# Altium project SynthyTwo.Project.PrjPcb (part 2 of 2)

## Sheet Encodeurs.Schematic.SchDoc
size A
Used 8 times, as channels A0, A1, B0, B1, C0, C1, D0, D1. Parts and nets are listed once, with the designators drawn on the sheet.
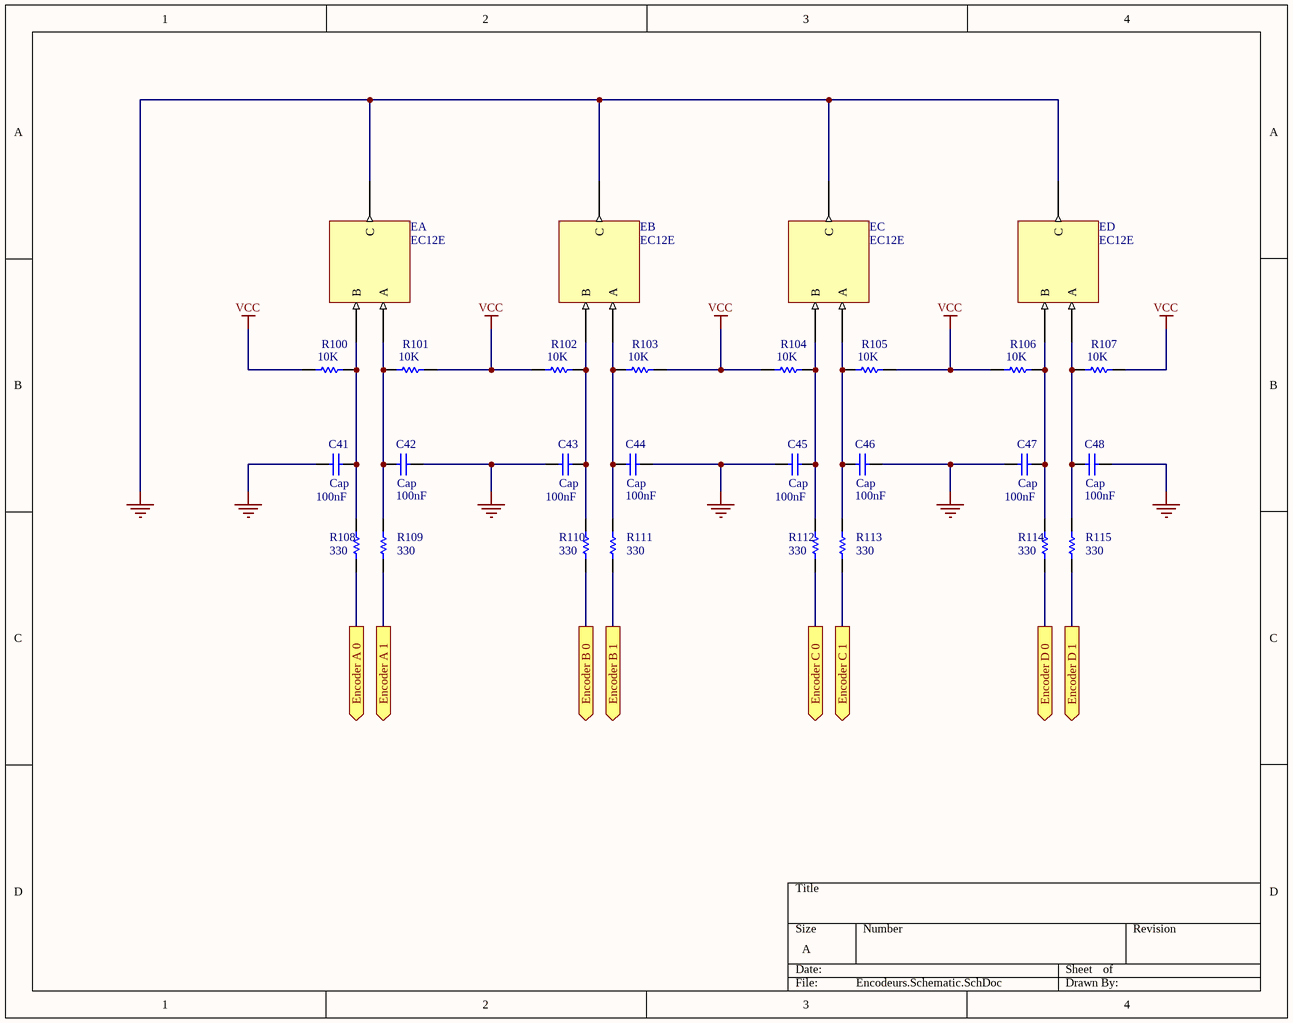
[diagram p10: Encodeurs.Schematic.SchDoc]

### Parts
C41  Cap  value 100nF  [CAPC1608N]
C42  Cap  value 100nF  [CAPC1608N]
C43  Cap  value 100nF  [CAPC1608N]
C44  Cap  value 100nF  [CAPC1608N]
C45  Cap  value 100nF  [CAPC1608N]
C46  Cap  value 100nF  [CAPC1608N]
C47  Cap  value 100nF  [CAPC1608N]
C48  Cap  value 100nF  [CAPC1608N]
EA  EC12E
EB  EC12E
EC  EC12E
ED  EC12E
R100  10K  [AXIAL-0.3]
R101  10K  [AXIAL-0.3]
R102  10K  [AXIAL-0.3]
R103  10K  [AXIAL-0.3]
R104  10K  [AXIAL-0.3]
R105  10K  [AXIAL-0.3]
R106  10K  [AXIAL-0.3]
R107  10K  [AXIAL-0.3]
R108  330  [AXIAL-0.3]
R109  330  [AXIAL-0.3]
R110  330  [AXIAL-0.3]
R111  330  [AXIAL-0.3]
R112  330  [AXIAL-0.3]
R113  330  [AXIAL-0.3]
R114  330  [AXIAL-0.3]
R115  330  [AXIAL-0.3]

### Ports
Encoder A 0 (out), Encoder A 1 (out), Encoder B 0 (out), Encoder B 1 (out), Encoder C 0 (out), Encoder C 1 (out), Encoder D 0 (out), Encoder D 1 (out)

### Nets
GND: C41.1 C42.1 C43.1 C44.1 C45.1 C46.1 C47.1 C48.1 EA.GND(C) EB.GND(C) EC.GND(C) ED.GND(C)
VCC: R100.1 R101.2 R102.1 R103.2 R104.1 R105.2 R106.1 R107.2
Encoder A 0: R108.1 ; port Encoder A 0
Encoder A 1: R109.1 ; port Encoder A 1
Encoder B 0: R110.1 ; port Encoder B 0
Encoder B 1: R111.1 ; port Encoder B 1
Encoder C 0: R112.1 ; port Encoder C 0
Encoder C 1: R113.1 ; port Encoder C 1
Encoder D 0: R114.1 ; port Encoder D 0
Encoder D 1: R115.1 ; port Encoder D 1
NetC41_2: C41.2 EA.Pin_B(B) R100.2 R108.2
NetC42_2: C42.2 EA.Pin_A(A) R101.1 R109.2
NetC43_2: C43.2 EB.Pin_B(B) R102.2 R110.2
NetC44_2: C44.2 EB.Pin_A(A) R103.1 R111.2
NetC45_2: C45.2 EC.Pin_B(B) R104.2 R112.2
NetC46_2: C46.2 EC.Pin_A(A) R105.1 R113.2
NetC47_2: C47.2 ED.Pin_B(B) R106.2 R114.2
NetC48_2: C48.2 ED.Pin_A(A) R107.1 R115.2

### Channels
A0: designators end in _A0; ports Encoder A 0=NetR108_A0_1 Encoder A 1=NetR109_A0_1 Encoder B 0=NetR110_A0_1 Encoder B 1=NetR111_A0_1 Encoder C 0=NetR112_A0_1 Encoder C 1=NetR113_A0_1 Encoder D 0=NetR114_A0_1 Encoder D 1=NetR115_A0_1
A1: designators end in _A1; ports Encoder A 0=NetR108_A1_1 Encoder A 1=NetR108_A0_1 Encoder B 0=NetR110_A1_1 Encoder B 1=NetR111_A1_1 Encoder C 0=NetR112_A1_1 Encoder C 1=NetR113_A1_1 Encoder D 0=NetR114_A1_1 Encoder D 1=NetR115_A1_1
B0: designators end in _B0; ports Encoder A 0=NetR108_B0_1 Encoder A 1=NetR109_B0_1 Encoder B 0=NetR108_A0_1 Encoder B 1=NetR111_B0_1 Encoder C 0=NetR112_B0_1 Encoder C 1=NetR113_B0_1 Encoder D 0=NetR114_B0_1 Encoder D 1=NetR115_B0_1
B1: designators end in _B1; ports Encoder A 0=NetR108_B1_1 Encoder A 1=NetR109_B1_1 Encoder B 0=NetR110_B1_1 Encoder B 1=NetR108_A0_1 Encoder C 0=NetR112_B1_1 Encoder C 1=NetR113_B1_1 Encoder D 0=NetR114_B1_1 Encoder D 1=NetR115_B1_1
C0: designators end in _C0; ports Encoder A 0=NetR108_C0_1 Encoder A 1=NetR109_C0_1 Encoder B 0=NetR110_C0_1 Encoder B 1=NetR111_C0_1 Encoder C 0=NetR108_A0_1 Encoder C 1=NetR113_C0_1 Encoder D 0=NetR114_C0_1 Encoder D 1=NetR115_C0_1
C1: designators end in _C1; ports Encoder A 0=NetR108_C1_1 Encoder A 1=NetR109_C1_1 Encoder B 0=NetR110_C1_1 Encoder B 1=NetR111_C1_1 Encoder C 0=NetR112_C1_1 Encoder C 1=NetR108_A0_1 Encoder D 0=NetR114_C1_1 Encoder D 1=NetR115_C1_1
D0: designators end in _D0; ports Encoder A 0=NetR108_D0_1 Encoder A 1=NetR109_D0_1 Encoder B 0=NetR110_D0_1 Encoder B 1=NetR111_D0_1 Encoder C 0=NetR112_D0_1 Encoder C 1=NetR113_D0_1 Encoder D 0=NetR108_A0_1 Encoder D 1=NetR115_D0_1
D1: designators end in _D1; ports Encoder A 0=NetR108_D1_1 Encoder A 1=NetR109_D1_1 Encoder B 0=NetR110_D1_1 Encoder B 1=NetR111_D1_1 Encoder C 0=NetR112_D1_1 Encoder C 1=NetR113_D1_1 Encoder D 0=NetR114_D1_1 Encoder D 1=NetR108_A0_1

### Library data of the parts
C41-C48 = Cap: Capacitor; Published: 8-Jun-2000; LatestRevisionDate: 17-Jul-2002; LatestRevisionNote: Re-released for DXP Platform.; PackageReference: RAD-0.3; Publisher: Altium Limited; PackageDescription: Radial Cap, Thru-Hole; 2 Leads; 0.3 in Pin Spacing
R100-R107 = Res1: Resistor; Published: 8-Jun-2000; LatestRevisionDate: 17-Jul-2002; LatestRevisionNote: Re-released for DXP Platform.; PackageReference: AXIAL-0.3; Publisher: Altium Limited; PackageDescription: Axial Device, Thru-Hole; 2 Leads; 0.3 in Pin Spacing; Value: 10K
R108-R115 = Res1: Resistor; Value: 330R; Published: 8-Jun-2000; LatestRevisionDate: 17-Jul-2002; LatestRevisionNote: Re-released for DXP Platform.; PackageReference: AXIAL-0.3; Publisher: Altium Limited; PackageDescription: Axial Device, Thru-Hole; 2 Leads; 0.3 in Pin Spacing

## Nets that join several sheets
+3.3V: PSU.Schematic (C2.1 VR1.3), LED1 (5 pins), LED2 (5 pins), LED3 (5 pins), LED4 (5 pins), LED5 (5 pins), LED6 (5 pins), LED7 (5 pins), LED8 (5 pins), LED9 (5 pins), SWITCH 1 (5 pins), SWITCH 2 (5 pins), SWITCH 3 (5 pins), SWITCH 4 (5 pins), SWITCH 5 (5 pins), RS (5 pins), ENABLE (5 pins), DATA  4 (5 pins), DATA 5 (5 pins), DATA 6 (5 pins), DATA 7 (5 pins)
+5V: PSU.Schematic (C4.1 VR2.3), DAC (C16_DAC.1 C17_DAC.2 U2_DAC.11), Multiplexeur (U22_Multiplexeur.5 U22_Multiplexeur.6), LED1 (*?_LED1.2 *?_LED1.16 P11_LED1.2), LED2 (*?_LED2.2 *?_LED2.16 P11_LED2.2), LED3 (*?_LED3.2 *?_LED3.16 P11_LED3.2), LED4 (*?_LED4.2 *?_LED4.16 P11_LED4.2), LED5 (*?_LED5.2 *?_LED5.16 P11_LED5.2), LED6 (*?_LED6.2 *?_LED6.16 P11_LED6.2), LED7 (*?_LED7.2 *?_LED7.16 P11_LED7.2), LED8 (*?_LED8.2 *?_LED8.16 P11_LED8.2), LED9 (*?_LED9.2 *?_LED9.16 P11_LED9.2), SWITCH 1 (*?_SWITCH_1.2 *?_SWITCH_1.16 P11_SWITCH_1.2), SWITCH 2 (*?_SWITCH_2.2 *?_SWITCH_2.16 P11_SWITCH_2.2), SWITCH 3 (*?_SWITCH_3.2 *?_SWITCH_3.16 P11_SWITCH_3.2), SWITCH 4 (*?_SWITCH_4.2 *?_SWITCH_4.16 P11_SWITCH_4.2), SWITCH 5 (*?_SWITCH_5.2 *?_SWITCH_5.16 P11_SWITCH_5.2), SCK (C16_SCK.1 C17_SCK.2 U2_SCK.11), DATA (C16_DATA.1 C17_DATA.2 U2_DATA.11), BCK (C16_BCK.1 C17_BCK.2 U2_BCK.11), LRCK (C16_LRCK.1 C17_LRCK.2 U2_LRCK.11), RS (*?_RS.2 *?_RS.16 P11_RS.2), ENABLE (*?_ENABLE.2 *?_ENABLE.16 P11_ENABLE.2), DATA  4 (*?_DATA_4.2 *?_DATA_4.16 P11_DATA_4.2), DATA 5 (*?_DATA_5.2 *?_DATA_5.16 P11_DATA_5.2), DATA 6 (*?_DATA_6.2 *?_DATA_6.16 P11_DATA_6.2), DATA 7 (*?_DATA_7.2 *?_DATA_7.16 P11_DATA_7.2), MIDI.Schematic (?.?3 R4.2 R6.2), A0 (U22_A0.5 U22_A0.6), A1 (U22_A1.5 U22_A1.6)
+9V: PSU.Schematic (C7.1 R1.2 VR3.3), FilterBoard.Schematic (14 pins), Controle du Filtre (U19_Controle_du_Filtre.4 U20_Controle_du_Filtre.4 U21_Controle_du_Filtre.4), Multiplexeur (U23_Multiplexeur.8 U24_Multiplexeur.8 U25_Multiplexeur.4), Frequency (U19_Frequency.4 U20_Frequency.4 U21_Frequency.4), Resonance (U19_Resonance.4 U20_Resonance.4 U21_Resonance.4), Mod (U19_Mod.4 U20_Mod.4 U21_Mod.4), A0 (U23_A0.8 U24_A0.8 U25_A0.4), A1 (U23_A1.8 U24_A1.8 U25_A1.4)
-9V: PSU.Schematic (C10.2 R2.1 VR4.3), FilterBoard.Schematic (16 pins), Controle du Filtre (5 pins), Multiplexeur (U23_Multiplexeur.4 U24_Multiplexeur.4 U25_Multiplexeur.11), Frequency (5 pins), Resonance (5 pins), Mod (5 pins), A0 (U23_A0.4 U24_A0.4 U25_A0.11), A1 (U23_A1.4 U24_A1.4 U25_A1.11)
GND: PSU.Schematic (15 pins), FilterBoard.Schematic (32 pins), Controle du Filtre (9 pins), Multiplexeur (8 pins), PIC.Schematic (8 pins), LED1 (16 pins), LED2 (16 pins), LED3 (16 pins), LED4 (16 pins), LED5 (16 pins), LED6 (16 pins), LED7 (16 pins), LED8 (16 pins), LED9 (16 pins), SWITCH 1 (16 pins), SWITCH 2 (16 pins), SWITCH 3 (16 pins), SWITCH 4 (16 pins), SWITCH 5 (16 pins), RS (16 pins), ENABLE (16 pins), DATA  4 (16 pins), DATA 5 (16 pins), DATA 6 (16 pins), DATA 7 (16 pins), MIDI.Schematic (?.?4 J3.2 R8.1), Frequency (9 pins), Resonance (9 pins), Mod (9 pins), A0 (8 pins), A1 (8 pins), A0 (12 pins), A1 (12 pins), B0 (12 pins), B1 (12 pins), C0 (12 pins), C1 (12 pins), D0 (12 pins), D1 (12 pins)
NetC15_BCK_2: DAC (8 pins), SCK (8 pins), DATA (8 pins), BCK (8 pins), LRCK (8 pins)
VCC: A0 (8 pins), A1 (8 pins), B0 (8 pins), B1 (8 pins), C0 (8 pins), C1 (8 pins), D0 (8 pins), D1 (8 pins)
BPO: FilterBoard.Schematic (R15.2), Multiplexeur (U22_Multiplexeur.7)
DAC0: PIC.Schematic (U1.51), SCK (R9_SCK.1)
DAC1: PIC.Schematic (U1.4), DATA (R10_DATA.1)
DAC2: PIC.Schematic (U1.6), BCK (R11_BCK.1)
DAC3: PIC.Schematic (U1.52), LRCK (R12_LRCK.1)
DI4: PIC.Schematic (U1.28), DATA  4 (*?_DATA_4.10)
DI5: PIC.Schematic (U1.27), DATA 5 (*?_DATA_5.9)
DI6: PIC.Schematic (U1.24), DATA 6 (*?_DATA_6.8)
DI7: PIC.Schematic (U1.23), DATA 7 (*?_DATA_7.7)
DIE: PIC.Schematic (U1.29), ENABLE (*?_ENABLE.6)
DIE: PIC.Schematic (U1.30), RS (*?_RS.4)
DIN: PIC.Schematic (U1.47), A1 (U22_A1.10)
freq: FilterBoard.Schematic (R57.1), Controle du Filtre (R65_Controle_du_Filtre.1 R69_Controle_du_Filtre.1 U19_Controle_du_Filtre.1)
FREQ: PIC.Schematic (U1.46), Frequency (R65_Frequency.1 R69_Frequency.1 U19_Frequency.1)
FTIN: FilterBoard.Schematic (R16.1), DAC (C14_DAC.2), Multiplexeur (U22_Multiplexeur.2)
HPO: FilterBoard.Schematic (R14.2), Multiplexeur (U22_Multiplexeur.9)
LED1: PIC.Schematic (U1.53), LED1 (R86_LED1.1)
LED2: PIC.Schematic (U1.54), LED2 (R87_LED2.1)
LED3: PIC.Schematic (U1.55), LED3 (R88_LED3.1)
LED4: PIC.Schematic (U1.58), LED4 (R94_LED4.1)
LED5: PIC.Schematic (U1.2), LED5 (R95_LED5.1)
LED6: PIC.Schematic (U1.3), LED6 (R96_LED6.1)
LED7: PIC.Schematic (U1.5), LED7 (R97_LED7.1)
LED8: PIC.Schematic (U1.8), LED8 (R98_LED8.1)
LED9: PIC.Schematic (U1.22), LED9 (R99_LED9.1)
LPO: FilterBoard.Schematic (R22.2), Multiplexeur (U22_Multiplexeur.4)
MIDI: PIC.Schematic (U1.21), MIDI.Schematic (?.?6 R6.1 R7.2)
mod: FilterBoard.Schematic (R48.1), Controle du Filtre (R76_Controle_du_Filtre.1 R78_Controle_du_Filtre.1 U21_Controle_du_Filtre.1)
MOD: PIC.Schematic (U1.50), Mod (R76_Mod.1 R78_Mod.1 U21_Mod.1)
MPX0: PIC.Schematic (U1.48), A0 (U22_A0.1)
NetR108_A0_1: A0 (R108_A0.1), A1 (R109_A1.1), B0 (R110_B0.1), B1 (R111_B1.1), C0 (R112_C0.1), C1 (R113_C1.1), D0 (R114_D0.1), D1 (R115_D1.1)
reso: FilterBoard.Schematic (R53.1), Controle du Filtre (R71_Controle_du_Filtre.1 R75_Controle_du_Filtre.1 U20_Controle_du_Filtre.1)
RESO: PIC.Schematic (U1.49), Resonance (R71_Resonance.1 R75_Resonance.1 U20_Resonance.1)
SW1: PIC.Schematic (U1.59), SWITCH 1 (R93_SWITCH_1.1 S2_SWITCH_1.1)
SW2: PIC.Schematic (U1.60), SWITCH 2 (R92_SWITCH_2.1 S3_SWITCH_2.1)
SW3: PIC.Schematic (U1.1), SWITCH 3 (R91_SWITCH_3.1 S4_SWITCH_3.1)
SW4: PIC.Schematic (U1.11), SWITCH 4 (R90_SWITCH_4.1 S5_SWITCH_4.1)
SW5: PIC.Schematic (U1.18), SWITCH 5 (R89_SWITCH_5.1 S6_SWITCH_5.1)